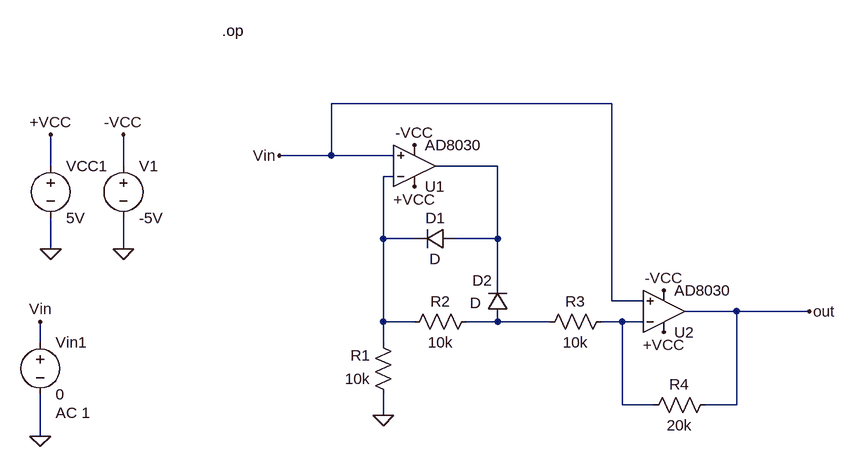
[diagram p0: schematic DCOP.asc]
DCOP.asc, the LTspice schematic file:
Version 4.1
SHEET 1 880 680
WIRE 432 -48 0 -48
WIRE 0 32 0 -48
WIRE 0 32 -80 32
WIRE 96 32 0 32
WIRE -432 48 -432 0
WIRE -320 48 -320 0
WIRE 256 48 160 48
WIRE 96 64 80 64
WIRE 80 160 80 64
WIRE 128 160 80 160
WIRE 256 160 256 48
WIRE 256 160 192 160
WIRE -432 176 -432 128
WIRE -320 176 -320 128
WIRE 256 224 256 160
WIRE 432 256 432 -48
WIRE 480 256 432 256
WIRE 624 272 544 272
WIRE 736 272 624 272
WIRE 80 288 80 160
WIRE 128 288 80 288
WIRE 256 288 208 288
WIRE 336 288 256 288
WIRE 448 288 416 288
WIRE 480 288 448 288
WIRE -448 320 -448 288
WIRE 80 320 80 288
WIRE 448 416 448 288
WIRE 496 416 448 416
WIRE 624 416 624 272
WIRE 624 416 576 416
WIRE 80 432 80 400
WIRE -448 464 -448 400
FLAG 80 432 0
FLAG -80 32 Vin
FLAG 736 272 out
FLAG -320 176 0
FLAG -432 176 0
FLAG -432 0 +VCC
FLAG -320 0 -VCC
FLAG 128 80 +VCC
FLAG 512 304 +VCC
FLAG 128 16 -VCC
FLAG 512 240 -VCC
FLAG -448 288 Vin
FLAG -448 464 0
DATAFLAG 672 272 ""
DATAFLAG -48 32 ""
SYMBOL OpAmps\\AD8030 128 112 M180
SYMATTR InstName U1
SYMBOL OpAmps\\AD8030 512 336 M180
SYMATTR InstName U2
SYMBOL diode 192 144 R90
WINDOW 0 0 32 VBottom 2
WINDOW 3 32 32 VTop 2
SYMATTR InstName D1
SYMBOL diode 272 288 R180
WINDOW 0 24 64 Left 2
WINDOW 3 41 29 Left 2
SYMATTR InstName D2
SYMBOL res 96 416 R180
WINDOW 0 36 76 Left 2
WINDOW 3 36 40 Left 2
SYMATTR InstName R1
SYMATTR Value 10k
SYMBOL res 224 272 R90
WINDOW 0 0 56 VBottom 2
WINDOW 3 32 56 VTop 2
SYMATTR InstName R2
SYMATTR Value 10k
SYMBOL res 432 272 R90
WINDOW 0 0 56 VBottom 2
WINDOW 3 32 56 VTop 2
SYMATTR InstName R3
SYMATTR Value 10k
SYMBOL res 592 400 R90
WINDOW 0 0 56 VBottom 2
WINDOW 3 32 56 VTop 2
SYMATTR InstName R4
SYMATTR Value 20k
SYMBOL voltage -432 32 R0
WINDOW 123 0 0 Left 0
WINDOW 39 0 0 Left 0
SYMATTR InstName VCC1
SYMATTR Value 5V
SYMBOL voltage -320 32 R0
WINDOW 123 0 0 Left 0
WINDOW 39 0 0 Left 0
SYMATTR InstName V1
SYMATTR Value -5V
SYMBOL voltage -448 304 R0
WINDOW 123 24 124 Left 2
WINDOW 39 0 0 Left 0
SYMATTR Value2 AC 1
SYMATTR InstName Vin1
SYMATTR Value 0
TEXT -168 -160 Left 2 !.op

The netlist it stands for:
* DCOP.asc
X§U1 Vin N002 +VCC -VCC N001 AD8040  ; AD8030, pins In+ In- V+ V- OUT
X§U2 Vin N004 +VCC -VCC out AD8040  ; AD8030, pins In+ In- V+ V- OUT
D1 N001 N002 D
D2 N003 N001 D
R1 0 N002 10k
R2 N003 N002 10k
R3 N004 N003 10k
R4 out N004 20k
VCC1 +VCC 0 5V
V1 -VCC 0 -5V
Vin1 Vin 0 0 AC 1
.model D D
.lib standard.dio
.op
.lib ADI.lib
.backanno
.end